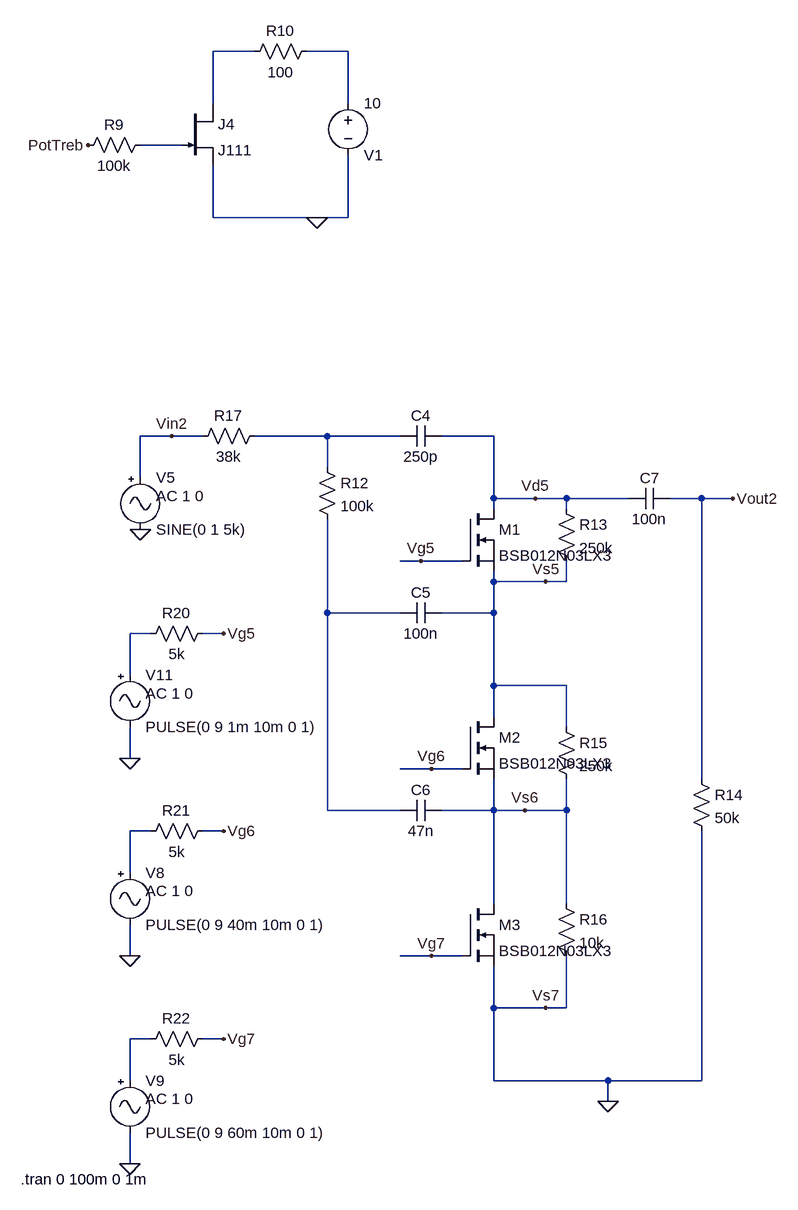
[diagram p0: schematic Mosfet_based_tonestack.asc]
Mosfet_based_tonestack.asc, the LTspice schematic file:
Version 4
SHEET 1 2360 1096
WIRE -304 -656 -368 -656
WIRE -160 -656 -224 -656
WIRE -368 -576 -368 -656
WIRE -160 -576 -160 -656
WIRE -416 -512 -480 -512
WIRE -368 -400 -368 -480
WIRE -208 -400 -368 -400
WIRE -160 -400 -160 -496
WIRE -160 -400 -208 -400
WIRE -432 -64 -480 -64
WIRE -384 -64 -432 -64
WIRE -192 -64 -304 -64
WIRE -80 -64 -192 -64
WIRE 64 -64 -16 -64
WIRE -192 -16 -192 -64
WIRE -480 0 -480 -64
WIRE 64 32 64 -64
WIRE 128 32 64 32
WIRE 176 32 128 32
WIRE 272 32 176 32
WIRE 384 32 336 32
WIRE 432 32 384 32
WIRE 64 48 64 32
WIRE 176 48 176 32
WIRE -48 128 -80 128
WIRE 16 128 -48 128
WIRE 64 160 64 144
WIRE 144 160 64 160
WIRE 176 160 176 128
WIRE 176 160 144 160
WIRE -192 208 -192 64
WIRE -80 208 -192 208
WIRE 64 208 64 160
WIRE 64 208 -16 208
WIRE -464 240 -496 240
WIRE -352 240 -384 240
WIRE -496 304 -496 240
WIRE 64 320 64 208
WIRE 176 320 64 320
WIRE 64 368 64 320
WIRE 176 384 176 320
WIRE -496 432 -496 384
WIRE -32 448 -80 448
WIRE 16 448 -32 448
WIRE 384 464 384 32
WIRE -192 512 -192 208
WIRE -80 512 -192 512
WIRE 64 512 64 464
WIRE 64 512 -16 512
WIRE 112 512 64 512
WIRE 176 512 176 464
WIRE 176 512 112 512
WIRE -464 544 -496 544
WIRE -352 544 -384 544
WIRE -496 608 -496 544
WIRE 64 656 64 512
WIRE 176 656 176 512
WIRE -496 736 -496 688
WIRE -32 736 -80 736
WIRE 16 736 -32 736
WIRE 64 816 64 752
WIRE 144 816 64 816
WIRE 176 816 176 736
WIRE 176 816 144 816
WIRE -464 864 -496 864
WIRE -352 864 -384 864
WIRE -496 928 -496 864
WIRE 64 928 64 816
WIRE 240 928 64 928
WIRE 384 928 384 544
WIRE 384 928 240 928
WIRE 240 960 240 928
WIRE -496 1056 -496 1008
FLAG -560 -512 PotTreb
FLAG -208 -400 0
FLAG 240 960 0
FLAG 144 160 Vs5
FLAG 112 512 Vs6
FLAG 144 816 Vs7
FLAG 128 32 Vd5
FLAG -48 128 Vg5
FLAG -32 448 Vg6
FLAG -32 736 Vg7
FLAG -480 80 0
FLAG 432 32 Vout2
FLAG -432 -64 Vin2
FLAG -496 432 0
FLAG -352 240 Vg5
FLAG -496 736 0
FLAG -352 544 Vg6
FLAG -496 1056 0
FLAG -352 864 Vg7
SYMBOL voltage -160 -592 R0
WINDOW 0 24 96 Left 2
WINDOW 3 24 16 Left 2
WINDOW 123 0 0 Left 0
WINDOW 39 0 0 Left 0
SYMATTR InstName V1
SYMATTR Value 10
SYMBOL njf -416 -576 R0
SYMATTR InstName J4
SYMATTR Value J111
SYMBOL res -464 -528 R90
WINDOW 0 0 56 VBottom 2
WINDOW 3 32 56 VTop 2
SYMATTR InstName R9
SYMATTR Value 100k
SYMBOL res -208 -672 R90
WINDOW 0 0 56 VBottom 2
WINDOW 3 32 56 VTop 2
SYMATTR InstName R10
SYMATTR Value 100
SYMBOL cap -16 -80 R90
WINDOW 0 0 32 VBottom 2
WINDOW 3 32 32 VTop 2
SYMATTR InstName C4
SYMATTR Value 250p
SYMBOL res -208 -32 R0
SYMATTR InstName R12
SYMATTR Value 100k
SYMBOL cap -16 192 R90
WINDOW 0 0 32 VBottom 2
WINDOW 3 32 32 VTop 2
SYMATTR InstName C5
SYMATTR Value 100n
SYMBOL res 160 32 R0
SYMATTR InstName R13
SYMATTR Value 250k
SYMBOL cap -16 496 R90
WINDOW 0 0 32 VBottom 2
WINDOW 3 32 32 VTop 2
SYMATTR InstName C6
SYMATTR Value 47n
SYMBOL res 368 448 R0
SYMATTR InstName R14
SYMATTR Value 50k
SYMBOL res 160 368 R0
SYMATTR InstName R15
SYMATTR Value 250k
SYMBOL res 160 640 R0
SYMATTR InstName R16
SYMATTR Value 10k
SYMBOL cap 336 16 R90
WINDOW 0 0 32 VBottom 2
WINDOW 3 32 32 VTop 2
SYMATTR InstName C7
SYMATTR Value 100n
SYMBOL Misc\\signal -480 -16 R0
WINDOW 123 24 44 Left 2
WINDOW 39 0 0 Left 0
SYMATTR Value2 AC 1 0
SYMATTR InstName V5
SYMATTR Value SINE(0 1 5k)
SYMBOL res -288 -80 R90
WINDOW 0 0 56 VBottom 2
WINDOW 3 32 56 VTop 2
SYMATTR InstName R17
SYMATTR Value 38k
SYMBOL res -368 224 R90
WINDOW 0 0 56 VBottom 2
WINDOW 3 32 56 VTop 2
SYMATTR InstName R20
SYMATTR Value 5k
SYMBOL res -368 528 R90
WINDOW 0 0 56 VBottom 2
WINDOW 3 32 56 VTop 2
SYMATTR InstName R21
SYMATTR Value 5k
SYMBOL res -368 848 R90
WINDOW 0 0 56 VBottom 2
WINDOW 3 32 56 VTop 2
SYMATTR InstName R22
SYMATTR Value 5k
SYMBOL Misc\\signal -496 288 R0
WINDOW 123 24 44 Left 2
WINDOW 39 0 0 Left 0
SYMATTR Value2 AC 1 0
SYMATTR InstName V11
SYMATTR Value PULSE(0 9 1m 10m 0 1)
SYMBOL Misc\\signal -496 592 R0
WINDOW 123 24 44 Left 2
WINDOW 39 0 0 Left 0
SYMATTR Value2 AC 1 0
SYMATTR InstName V8
SYMATTR Value PULSE(0 9 40m 10m 0 1)
SYMBOL Misc\\signal -496 912 R0
WINDOW 123 24 44 Left 2
WINDOW 39 0 0 Left 0
SYMATTR Value2 AC 1 0
SYMATTR InstName V9
SYMATTR Value PULSE(0 9 60m 10m 0 1)
SYMBOL nmos 16 48 R0
SYMATTR InstName M1
SYMATTR Value BSB012N03LX3
SYMBOL nmos 16 368 R0
SYMATTR InstName M2
SYMATTR Value BSB012N03LX3
SYMBOL nmos 16 656 R0
SYMATTR InstName M3
SYMATTR Value BSB012N03LX3
TEXT -664 1080 Left 2 !.tran 0 100m 0 1m

The netlist it stands for:
* Mosfet_based_tonestack.asc
V1 N002 0 10
J4 N001 N003 0 J111
R9 N003 PotTreb 100k
R10 N002 N001 100
C4 Vd5 N004 250p
R12 N004 N005 100k
C5 Vs5 N005 100n
R13 Vd5 Vs5 250k
C6 Vs6 N005 47n
R14 Vout2 0 50k
R15 Vs5 Vs6 250k
R16 Vs6 0 10k
C7 Vout2 Vd5 100n
V5 Vin2 0 SINE(0 1 5k) AC 1 0
R17 N004 Vin2 38k
R20 Vg5 N006 5k
R21 Vg6 N007 5k
R22 Vg7 N008 5k
V11 N006 0 PULSE(0 9 1m 10m 0 1) AC 1 0
V8 N007 0 PULSE(0 9 40m 10m 0 1) AC 1 0
V9 N008 0 PULSE(0 9 60m 10m 0 1) AC 1 0
M1 Vd5 Vg5 Vs5 Vs5 BSB012N03LX3
M2 Vs5 Vg6 Vs6 Vs6 BSB012N03LX3
M3 Vs6 Vg7 0 0 BSB012N03LX3
.model NJF NJF
.model PJF PJF
.lib standard.jft
.model NMOS NMOS
.model PMOS PMOS
.lib standard.mos
.tran 0 100m 0 1m
.backanno
.end